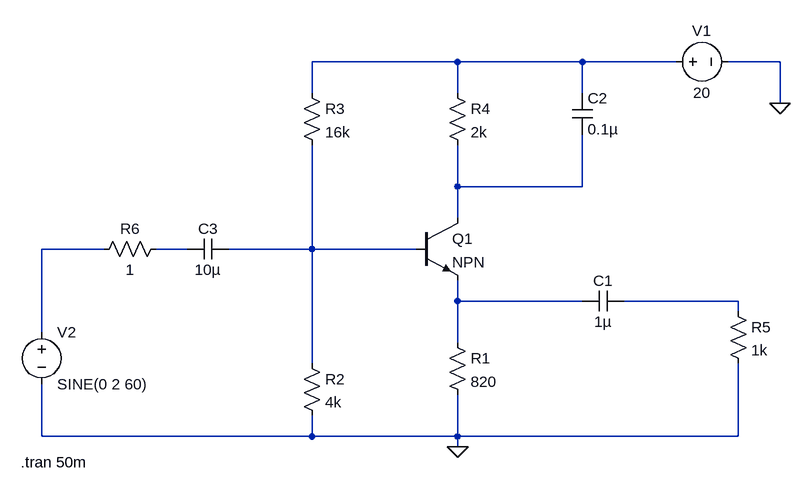
[diagram p0: schematic BJTTransistorCommonCollectorAmplfierNpn.asc]
BJTTransistorCommonCollectorAmplfierNpn.asc, the LTspice schematic file:
Version 4.1
SHEET 1 1124 680
WIRE 240 -16 16 -16
WIRE 432 -16 240 -16
WIRE 576 -16 432 -16
WIRE 736 -16 656 -16
WIRE 16 32 16 -16
WIRE 240 32 240 -16
WIRE 432 32 432 -16
WIRE 736 48 736 -16
WIRE 240 176 240 112
WIRE 432 176 432 96
WIRE 432 176 240 176
WIRE 240 224 240 176
WIRE -304 272 -400 272
WIRE -176 272 -224 272
WIRE 16 272 16 112
WIRE 16 272 -112 272
WIRE 176 272 16 272
WIRE 240 352 240 320
WIRE 432 352 240 352
WIRE 672 352 496 352
WIRE 672 368 672 352
WIRE -400 400 -400 272
WIRE 240 416 240 352
WIRE 16 448 16 272
WIRE -400 560 -400 480
WIRE 16 560 16 528
WIRE 16 560 -400 560
WIRE 240 560 240 496
WIRE 240 560 16 560
WIRE 672 560 672 448
WIRE 672 560 240 560
WIRE 240 576 240 560
FLAG 240 576 0
FLAG 736 48 0
SYMBOL res 224 400 R0
SYMATTR InstName R1
SYMATTR Value 820
SYMBOL res 0 432 R0
SYMATTR InstName R2
SYMATTR Value 4k
SYMBOL res 0 16 R0
SYMATTR InstName R3
SYMATTR Value 16k
SYMBOL res 224 16 R0
SYMATTR InstName R4
SYMATTR Value 2k
SYMBOL npn 176 224 R0
SYMATTR InstName Q1
SYMBOL res 656 352 R0
SYMATTR InstName R5
SYMATTR Value 1k
SYMBOL cap 496 336 R90
WINDOW 0 0 32 VBottom 2
WINDOW 3 32 32 VTop 2
SYMATTR InstName C1
SYMATTR Value 1µ
SYMBOL cap 416 32 R0
SYMATTR InstName C2
SYMATTR Value 0.1µ
SYMBOL voltage 560 -16 R270
WINDOW 0 32 56 VTop 2
WINDOW 3 -32 56 VBottom 2
WINDOW 123 0 0 Left 0
WINDOW 39 0 0 Left 0
SYMATTR InstName V1
SYMATTR Value 20
SYMBOL res -208 256 R90
WINDOW 0 0 56 VBottom 2
WINDOW 3 32 56 VTop 2
SYMATTR InstName R6
SYMATTR Value 1
SYMBOL cap -112 256 R90
WINDOW 0 0 32 VBottom 2
WINDOW 3 32 32 VTop 2
SYMATTR InstName C3
SYMATTR Value 10µ
SYMBOL voltage -400 384 R0
WINDOW 123 0 0 Left 0
WINDOW 39 0 0 Left 0
SYMATTR InstName V2
SYMATTR Value SINE(0 2 60)
TEXT -432 600 Left 2 !.tran 50m

The netlist it stands for:
* BJTTransistorCommonCollectorAmplfierNpn.asc
R1 N006 0 820
R2 N005 0 4k
R3 N001 N005 16k
R4 N001 N002 2k
Q1 N002 N005 N006 0 NPN
R5 N007 0 1k
C1 N007 N006 1µ
C2 N001 N002 0.1µ
V1 N001 0 20
R6 N004 N003 1
C3 N005 N004 10µ
V2 N003 0 SINE(0 2 60)
.model NPN NPN
.model PNP PNP
.lib standard.bjt
.tran 50m
.backanno
.end